# Altium schematic sheet codec.SchDoc
size Letter
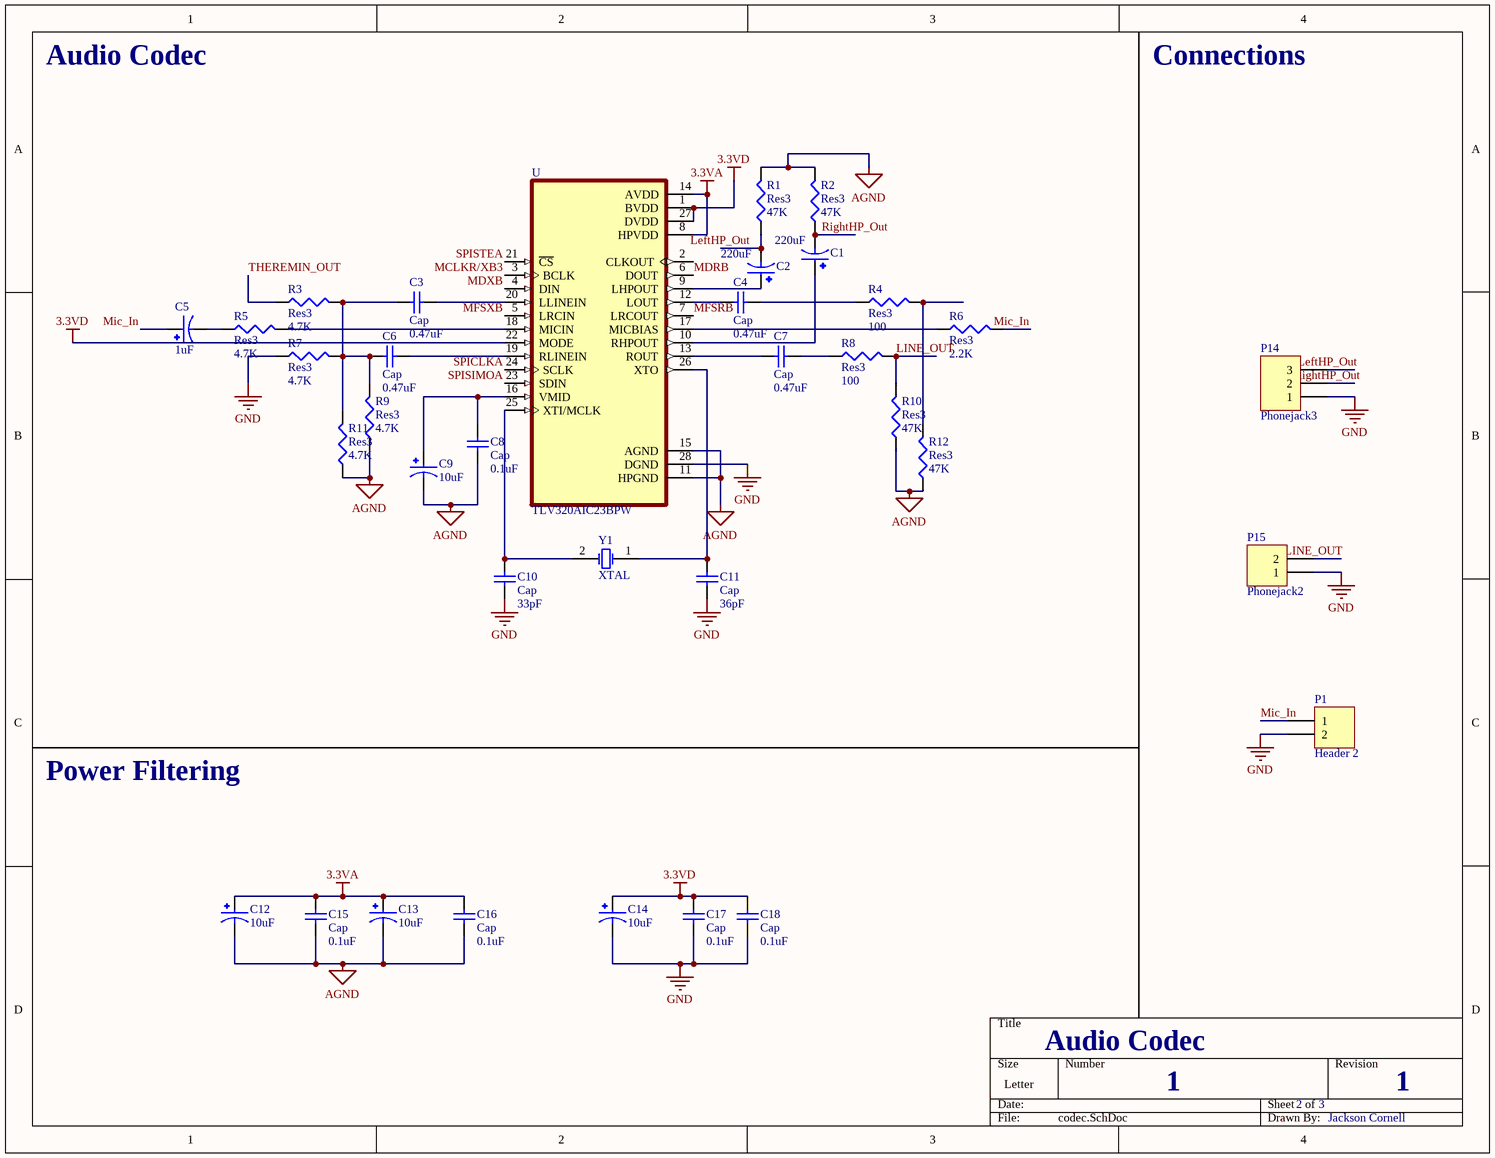
[diagram p0: codec.SchDoc]

## Parts
C1  value 220uF  [CAPPRD500W60D1000H1250]  (hidden comment: EEUFC1V221E)
C2  value 220uF  [CAPPRD500W60D1000H1250]  (hidden comment: EEUFC1V221E)
C3  Cap  value 0.47uF  [CAPC0805]
C4  Cap  value 0.47uF  [CAPC0805]
C5  value 1uF  [CAPPRD500W60D1000H1250]  (hidden comment: EEUFC1V221E)
C6  Cap  value 0.47uF  [CAPC0805]
C7  Cap  value 0.47uF  [CAPC0805]
C8  Cap  value 0.1uF  [CAPC0805]
C9  value 10uF  [CAPPRD500W60D1000H1250]  (hidden comment: EEUFC1V221E)
C10  Cap  value 33pF  [CAPC0805]
C11  Cap  value 36pF  [CAPC0805]
C12  value 10uF  [CAPPRD500W60D1000H1250]  (hidden comment: EEUFC1V221E)
C13  value 10uF  [CAPPRD500W60D1000H1250]  (hidden comment: EEUFC1V221E)
C14  value 10uF  [CAPPRD500W60D1000H1250]  (hidden comment: EEUFC1V221E)
C15  Cap  value 0.1uF  [CAPC0805]
C16  Cap  value 0.1uF  [CAPC0805]
C17  Cap  value 0.1uF  [CAPC0805]
C18  Cap  value 0.1uF  [CAPC0805]
P1  Header 2  [HDR1X2]
P14  Phonejack3  [HDR1X3]
P15  Phonejack2  [HDR1X2]
R1  Res3  value 47K  [RES0805]
R2  Res3  value 47K  [RES0805]
R3  Res3  value 4.7K  [RES0805]
R4  Res3  value 100  [RES0805]
R5  Res3  value 4.7K  [RES0805]
R6  Res3  value 2.2K  [RES0805]
R7  Res3  value 4.7K  [RES0805]
R8  Res3  value 100  [RES0805]
R9  Res3  value 4.7K  [RES0805]
R10  Res3  value 47K  [RES0805]
R11  Res3  value 4.7K  [RES0805]
R12  Res3  value 47K  [RES0805]
U  TLV320AIC23BPW  [SOP65P640X120-28N]
Y1  XTAL  [R38]

## Nets
3.3VA: C12.P C13.P C15.1 C16.1 U.8(HPVDD) U.14(AVDD)
3.3VD: C14.P C17.2 C18.2 U.1(BVDD) U.22(MODE) U.27(DVDD)
AGND: C8.1 C9.N C12.N C13.N C15.2 C16.2 R1.2 R2.2 R9.1 R10.1 R11.1 R12.1 U.11(HPGND) U.15(AGND)
GND: C10.2 C11.2 C14.N C17.1 C18.1 P1.2 P14.1 P15.1 R7.1 U.28(DGND)
LeftHP_Out: C2.N P14.3 R1.1
LINE_OUT: P15.2 R8.2 R10.2
MCLKR/XB3: U.3(BCLK)
MDRB: U.6(DOUT)
MDXB: U.4(DIN)
MFSRB: U.7(LRCOUT)
MFSXB: U.5(LRCIN)
Mic_In: C5.P P1.1 R6.2
RightHP_Out: C1.N P14.2 R2.1
SPICLKA: U.24(SCLK)
SPISIMOA: U.23(SDIN)
SPISTEA: U.21(~{CS})
THEREMIN_OUT: R3.1
NetC1_P: C1.P U.10(RHPOUT)
NetC2_P: C2.P U.9(LHPOUT)
NetC3_1: C3.1 C6.1 R3.2 R7.2 R9.2 R11.2
NetC3_2: C3.2 U.20(LLINEIN)
NetC4_1: C4.1 U.12(LOUT)
NetC4_2: C4.2 R4.1
NetC5_N: C5.N R5.1
NetC6_2: C6.2 U.19(RLINEIN)
NetC7_1: C7.1 U.13(ROUT)
NetC7_2: C7.2 R8.1
NetC8_2: C8.2 C9.P U.16(VMID)
NetC10_1: C10.1 U.25(XTI/MCLK) Y1.2(OSC2)
NetC11_1: C11.1 U.26(XTO) Y1.1(OSC1)
NetR4_2: R4.2 R12.2
NetR5_2: R5.2 U.18(MICIN)
NetR6_1: R6.1 U.17(MICBIAS)

Not connected (* = marked no-connect by the designer): U 2(CLKOUT)

## Notes on the sheet
- Audio Codec
- Connections
- Power Filtering
- 1
- 2
- 3
- Jackson Cornell

## Library data of the parts
C1 C2 C5 C9 C12-C14 = EEUFC1V221E: Aluminum Electrolytic Capacitors - Radial Leaded; MP: EEU-FC1V221E; MF: Panasonic; SnapEDA_Link: https://www.snapeda.com/parts/EEU-FC1V221E/Panasonic/view-part/6222388/?ref=snap; Availability: In Stock; Purchase-URL: https://pricing.snapeda.com/search/part/EEU-FC1V221E/?ref=eda; Check_prices: https://www.snapeda.com/parts/EEU-FC1V221E/Panasonic/view-part/6222388/?ref=eda; Package: RADIAL-2 Panasonic; Price: None
C3 C4 C6-C8 C10 C11 C15-C18 = Cap: Capacitor; Published: 8-Jun-2000; LatestRevisionDate: 17-Jul-2002; LatestRevisionNote: Re-released for DXP Platform.; PackageReference: RAD-0.3; Publisher: Altium Limited; PackageDescription: Radial Cap, Thru-Hole; 2 Leads; 0.3 in Pin Spacing
P1 P15 = Header 2: Header, 2-Pin; LatestRevisionDate: 17-Jul-2002; LatestRevisionNote: Re-released for DXP Platform.; Publisher: Altium Limited
P14 = Header 3: Header, 3-Pin; LatestRevisionDate: 17-Jul-2002; LatestRevisionNote: Re-released for DXP Platform.; Publisher: Altium Limited
R1-R12 = Res3: Resistor; Published: 8-Jun-2000; LatestRevisionDate: 29-May-2009; LatestRevisionNote: IPC-7351 Footprint Added.; PackageReference: J1-0603; Publisher: Altium Limited; PackageDescription: Chip Resistor
U = TLV320AIC23BPW: Low-Power Stereo CODEC with HP Amplifier 28-TSSOP -10 to 70; MF: Texas Instruments; Availability: Warning; Package: TSSOP-28 Texas Instruments; MP: TLV320AIC23BPW; Texas_Instruments-Purchase-URL: https://snapeda.com/shop?store=Texas+Instruments&id=249064; DigiKey-Purchase-URL: https://snapeda.com/shop?store=DigiKey&id=249064; Value: *; Arrow_Electronics-Purchase-URL: https://snapeda.com/shop?store=Arrow+Electronics&id=249064; Mouser-Purchase-URL: https://snapeda.com/shop?store=Mouser&id=249064; Price: None; SnapEDA_Link: https://www.snapeda.com/parts/TLV320AIC23BPW/Texas%20Instruments/view-part/249064/?ref=snap
Y1 = XTAL: Crystal Oscillator; Published: 8-Jun-2000; LatestRevisionDate: 17-Jul-2002; LatestRevisionNote: Re-released for DXP Platform.; PackageReference: R38; Publisher: Altium Limited; PackageDescription: Crystal, Thru-Hole; 2 Leads; Body 3.1 x 8.2 mm (Dia.xH)